# EAGLE design main (EAGLE 7.4.0)
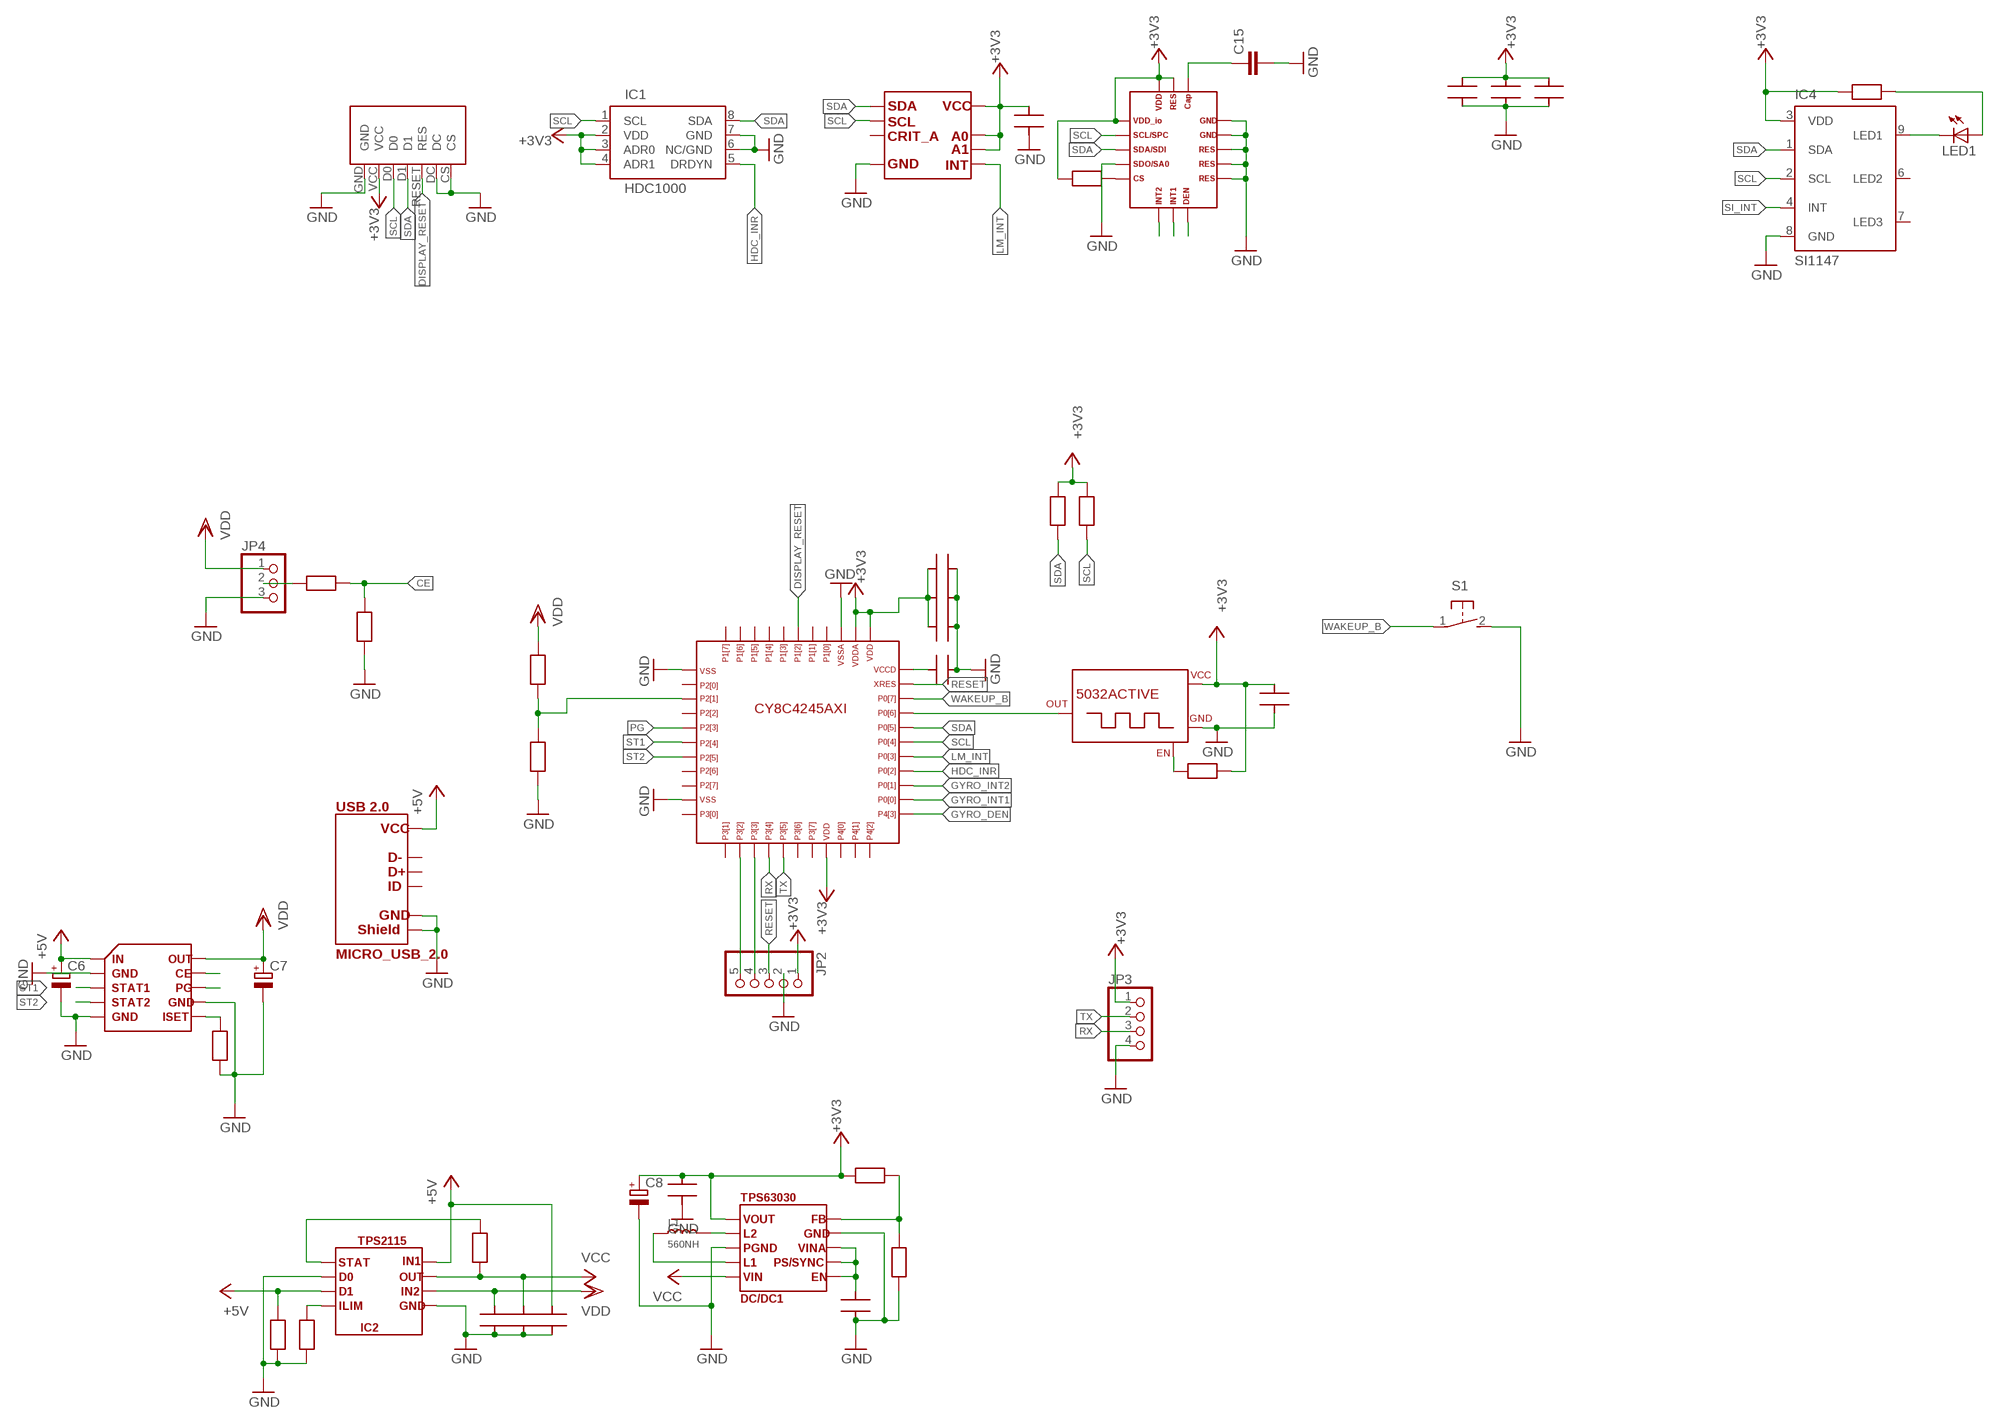
[diagram p0: schematic, sheet 1]

## Parts
C1  CAP0603  [C0603]
C2  CAP0603  [C0603]
C3  CAP0603  [C0603]
C4  CAP0603  [C0603]
C5  CAP0603  [C0603]
C6  CPOL-EUSMCA  [SMC_A]
C7  CPOL-EUSMCA  [SMC_A]
C8  CPOL-EUSMCA  [SMC_A]
C9  CAP0603  [C0603]
C10  CAP0603  [C0603]
C11  CAP0603  [C0603]
C12  CAP0603  [C0603]
C13  CAP0603  [C0603]
C14  CAP0603  [C0603]
C15  C-EUC1206  [C1206]
C18  CAP0603  [C0603]
C19  CAP0603  [C0603]
C20  CAP0603  [C0603]
DC/DC1  TPS63030  [WSON10]
DIS1  ER-OLED_BREACKOUT  [ER-OLED_BRECKOUT]
GYRO1  L3GD20H  [LGA_3X3_16]
IC1  HDC1000  [DSBGA-8]
IC2  TPS2115  [TSSOP8]
IC3  BQ24080-Q1,  [VSON10]
IC4  SI1147  [QFN-10]
JP2  PINHD-1X5  [1X05]
JP3  PINHD-1X4  [1X04]
JP4  PINHD-1X3  [1X03]
L1  560NH  SMD-INDUCTOR-560NH-10%(0805)  [L0805]
LED1  LED3MM  [LED3MM]
R1  RES0603  [R0603]
R2  RES0603  [R0603]
R3  RES0603  [R0603]
R4  RES0603  [R0603]
R5  RES0603  [R0603]
R6  RES0603  [R0603]
R7  RES0603  [R0603]
R8  RES0603  [R0603]
R9  RES0603  [R0603]
R10  RES0603  [R0603]
R11  RES0603  [R0603]
R12  RES0603  [R0603]
R13  RES0603  [R0603]
R14  RES0603  [R0603]
R15  RES0603  [R0603]
S1  31-XX  [B3F-31XX]
TMP1  LM92  [SOIC8-1.27-5X4MM]
U$1  CY8C4245  [TQFP44_CY_LOGO]
U$2  5032ACTIVE  [5030A]
USB_CON1  MICRO_USB_2.0  [MICRO-USB5+4P-SMD-0.65]

## Nets
+3V3: C5.2 C8.+ C10.2 C11.2 C12.2 C13.1 C14.1 C18.1 C19.1 C20.1 DC/DC1.P$1 DIS1.VCC GYRO1.1 GYRO1.15 GYRO1.16 IC1.2(VDD) IC1.3(ADR0) IC1.4(ADR1) IC4.3(VDD) JP2.1 JP3.1 R5.1 R9.2 R10.2 R11.1 R12.2 R13.2 TMP1.6(OUT) TMP1.7(OUT) TMP1.8(OUT) U$1.19 U$1.34 U$1.35 U$2.4(+5V)
+5V: C3.2 C6.+ IC2.P$3 IC2.P$8 IC3.P$1 R2.2 USB_CON1.1
CE: IC3.P$9 R14.1 R15.1
DISPLAY_RESET: DIS1.RESET(RES) U$1.39
GND: C1.1 C2.1 C3.1 C4.1 C5.1 C6.- C7.- C8.- C9.1 C10.1 C11.1 C12.1 C13.2 C14.2 C15.2 C18.2 C19.2 C20.2 DC/DC1.EPAD_B DC/DC1.EPAD_T DC/DC1.EPAD_VIA DC/DC1.P$3 DC/DC1.P$9 DIS1.CS DIS1.DC DIS1.GND GYRO1.4 GYRO1.9 GYRO1.10 GYRO1.11 GYRO1.12 GYRO1.13 IC1.6(NC/GND) IC1.7(GND) IC2.P$2 IC2.P$5 IC3.P$2 IC3.P$5 IC3.P$7 IC3.PAD1 IC3.PAD2 IC3.PAD3 IC3.PAD4 IC3.PAD5 IC4.8(GND) JP2.2 JP3.4 JP4.3 R1.1 R2.1 R4.2 R6.1 R8.1 R15.2 S1.2(S) TMP1.4(OUT) U$1.1 U$1.10 U$1.36 U$2.2(GND) USB_CON1.5 USB_CON1.P$1 USB_CON1.P$2 USB_CON1.P$3 USB_CON1.P$4
GYRO_DEN: GYRO1.8 U$1.23
GYRO_INT1: GYRO1.7 U$1.24
GYRO_INT2: GYRO1.6 U$1.25
HDC_INR: IC1.5(DRDYN) U$1.26
LM_INT: TMP1.5(OUT) U$1.27
N$1: C4.2 DC/DC1.P$6 DC/DC1.P$7 DC/DC1.P$8
N$2: DC/DC1.P$4 L1.1
N$3: DC/DC1.P$2 L1.2
N$4: DC/DC1.P$10 R4.1 R5.2
N$5: IC2.P$4 R1.2
N$6: C9.2 U$1.33
N$7: IC2.P$1 R3.2
N$8: IC3.P$6 R6.2
N$9: JP2.5 U$1.13
N$10: JP2.4 U$1.14
N$11: R7.1 R8.2 U$1.3
N$12: C15.1 GYRO1.14
N$13: U$1.30 U$2.3(OUT)
N$14: R11.2 U$2.1(EN)
N$15: GYRO1.5 R12.1
N$16: LED1.A R13.1
N$17: IC4.9(LED1) LED1.K(C)
N$20: JP4.2 R14.2
PG: IC3.P$8 U$1.5
RESET: JP2.3 U$1.32
RX: JP3.3 U$1.15
SCL: DIS1.D0 GYRO1.2 IC1.1(SCL) IC4.2(SCL) R10.1 TMP1.2(OUT) U$1.28
SDA: DIS1.D1 GYRO1.3 IC1.8(SDA) IC4.1(SDA) R9.1 TMP1.1(OUT) U$1.29
SI_INT: IC4.4(INT)
ST1: IC3.P$3 U$1.6
ST2: IC3.P$4 U$1.7
TX: JP3.2 U$1.16
VCC: C2.2 DC/DC1.P$5 IC2.P$7 R3.1
VDD: C1.2 C7.+ IC2.P$6 IC3.P$10 JP4.1 R7.2
WAKEUP_B: S1.1(P) U$1.31
Unconnected: IC4.6(LED2) IC4.7(LED3) TMP1.3(OUT) U$1.2 U$1.4 U$1.8 U$1.9 U$1.11 U$1.12 U$1.17 U$1.18 U$1.20 U$1.21 U$1.22 U$1.37 U$1.38 U$1.40 U$1.41 U$1.42 U$1.43 U$1.44 USB_CON1.2 USB_CON1.3 USB_CON1.4

## Library data of the parts
C1-C5 C9-C14 C18-C20 = My_RLC:CAP0603: Ceramic Capasitor SMD 0603
C6-C8 = rcl:CPOL-EU: POLARIZED CAPACITOR, European symbol
C15 = rcl:C-EU: CAPACITOR, European symbol
DC/DC1 = My_TI:TPS63030: HIGH EFFICIENCY SINGLE INDUCTOR BUCK-BOOST CONVERTER WITH 1-A SWITCHES. Input Voltage Range: 1.8V to 5.5V. http://www.ti.com/lit/ds/symlink/tps63030.pdf
DIS1 = Displays:ER-OLED_BREACKOUT
GYRO1 = Sensors:L3GD20H: MEMS motion sensor: three-axis digital output gyroscope. Wide supply voltage, 2.2 V to 3.6 V. Low voltage compatible IOs, 1.8 V. http://www.st.com/st-web-ui/static/active/en/resource/technical/document/datasheet/DM00060659.pdf
IC1 = My_TI:HDC1000: HDC1000 edit this description Auto generated by make-symbol-device-package-bsdl.ulp Rev. 43 Source: HDC1000.txt
IC2 = My_TI:TPS2115: AUTOSWITCHING POWER MULTIPLEXER. Wide Operating Voltage Range: 2.8 V to 5.5 V. Adjustable Current Limit. Low Standby Current: 0.5 µA Typical. http://www.ti.com/lit/ds/symlink/tps2115.pdf
IC3 = My_TI:BQ24080-Q1,: 1-A, Single Chip, Li-Ion and Li-Pol Automotive Charger. http://www.ti.com/lit/ds/symlink/bq24081-q1.pdf
IC4 = silabs:SI114*: PROXIMITY/UV/AMBIENT LIGHT SENSOR IC WITH I2C INTERFACE Source: http://www.silabs.com/Support%20Documents/TechnicalDocs/Si1145-46-47.pdf
JP2 = pinhead:PINHD-1X5: PIN HEADER
JP3 = pinhead:PINHD-1X4: PIN HEADER
JP4 = pinhead:PINHD-1X3: PIN HEADER
L1 = Seeed-OPL-Inductor:SMD-INDUCTOR-560NH-10%(0805): 303010046
LED1 = led:LED: LED OSRAM: - CHIPLED LG R971, LG N971, LY N971, LG Q971, LY Q971, LO R971, LY R971 LH N974, LH R974 LS Q976, LO Q976, LY Q976 LO Q996 - Hyper CHIPLED LW Q18S LB Q993, LB Q99A, LB R99A - SideLED LS A670, LO A670, LY A670, LG A670, LP A670 LB A673, LV A673, LT A673, LW A673 LH A674 LY A675 LS A676, LA A676, LO A676, LY A676, LW A676 LS A679, LY A679, LG A679 - Hyper Micro SIDELED® LS Y876, LA Y876, LO Y876, LY Y876 LT Y87S - SmartLED LW L88C, LW L88S LB L89C, LB L89S, LG L890 LS L89K, LO L89K, LY L89K LS L896, LA L896, LO L896, LY L896 - TOPLED LS T670, LO T670, LY T670, LG T670, LP T670 LSG T670, LSP T670, LSY T670, LOP T670, LYG T670 LG T671, LOG T671, LSG T671 LB T673, LV T673, LT T673, LW T673 LH T674 LS T676, LA T676, LO T676, LY T676, LB T676, LH T676, LSB T676, LW T676 LB T67C, LV T67C, LT T67C, LS T67K, LO T67K, LY T67K, LW E67C LS E67B, LA E67B, LO E67B, LY E67B, LB E67C, LV E67C, LT E67C LW T67C LS T679, LY T679, LG T679 LS T770, LO T770, LY T770, LG T770, LP T770 LB T773, LV T773, LT T773, LW T773 LH T774 LS E675, LA E675, LY E675, LS T675 LS T776, LA T776, LO T776, LY T776, LB T776 LHGB T686 LT T68C, LB T68C - Hyper Mini TOPLED® LB M676 - Mini TOPLED Santana® LG M470 LS M47K, LO M47K, LY M47K Source: http://www.osram.convergy.de LUXEON: - LUMILED® LXK2-PW12-R00, LXK2-PW12-S00, LXK2-PW14-U00, LXK2-PW14-V00 LXK2-PM12-R00, LXK2-PM12-S00, LXK2-PM14-U00 LXK2-PE12-Q00, LXK2-PE12-R00, LXK2-PE12-S00, LXK2-PE14-T00, LXK2-PE14-U00 LXK2-PB12-K00, LXK2-PB12-L00, LXK2-PB12-M00, LXK2-PB14-N00, LXK2-PB14-P00, LXK2-PB14-Q00 LXK2-PR12-L00, LXK2-PR12-M00, LXK2-PR14-Q00, LXK2-PR14-R00 LXK2-PD12-Q00, LXK2-PD12-R00, LXK2-PD12-S00 LXK2-PH12-R00, LXK2-PH12-S00 LXK2-PL12-P00, LXK2-PL12-Q00, LXK2-PL12-R00 Source: www.luxeon.com KINGBRIGHT: KA-3528ASYC Source: www.kingbright.com
R1-R15 = My_RLC:RES0603: Resistor SMD 0603
S1 = switch-omron:31-XX: OMRON SWITCH; MPN: B3F-3100; OC_FARNELL: 959704; OC_NEWARK: 36M3582
TMP1 = My_TI:LM92: ±0.33°C Accurate, 12-Bit + Sign Temperature Sensor and Thermal Window Comparator With Two-Wire Interface
U$1 = PsoC:CY8C4245
U$2 = Oscillatrs:5032ACTIVE
USB_CON1 = Interface:MICRO_USB_2.0: Micro USB 2.0

## Board
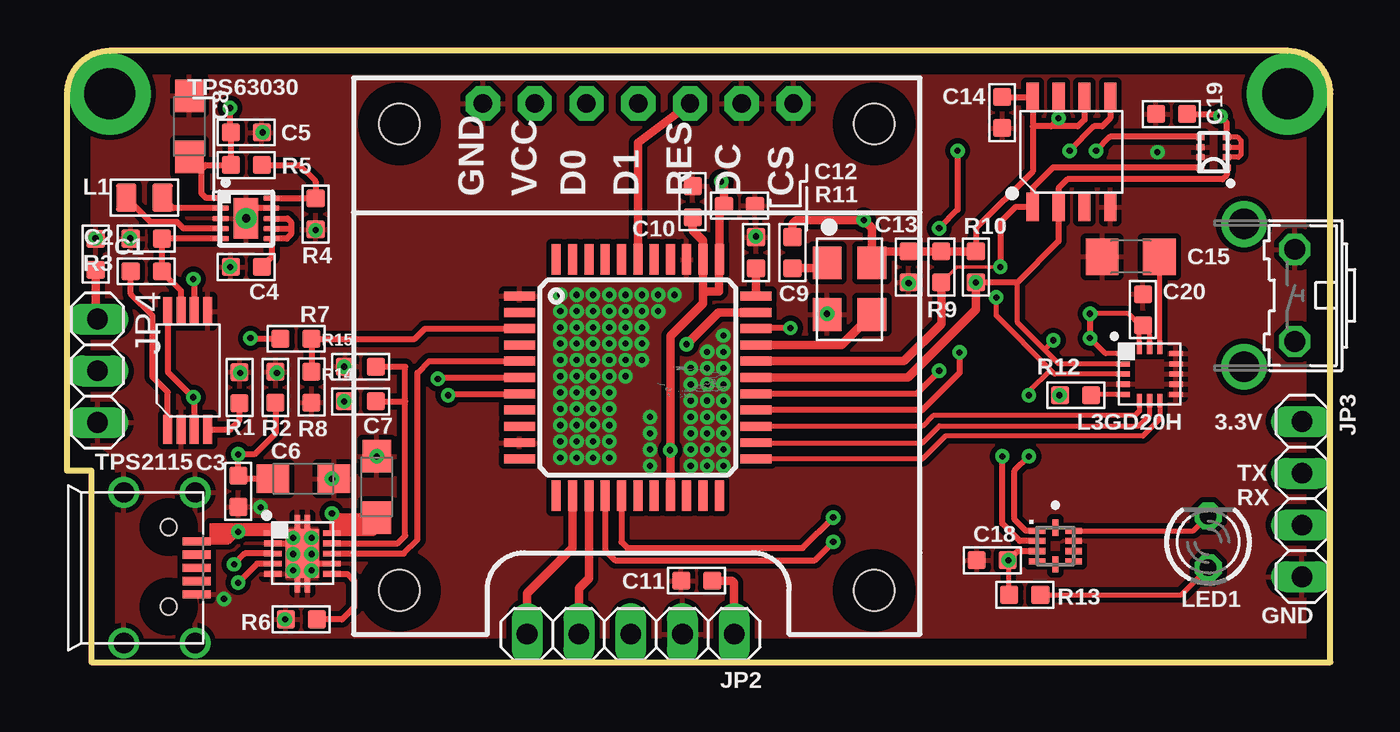
[diagram p1: board, top side]
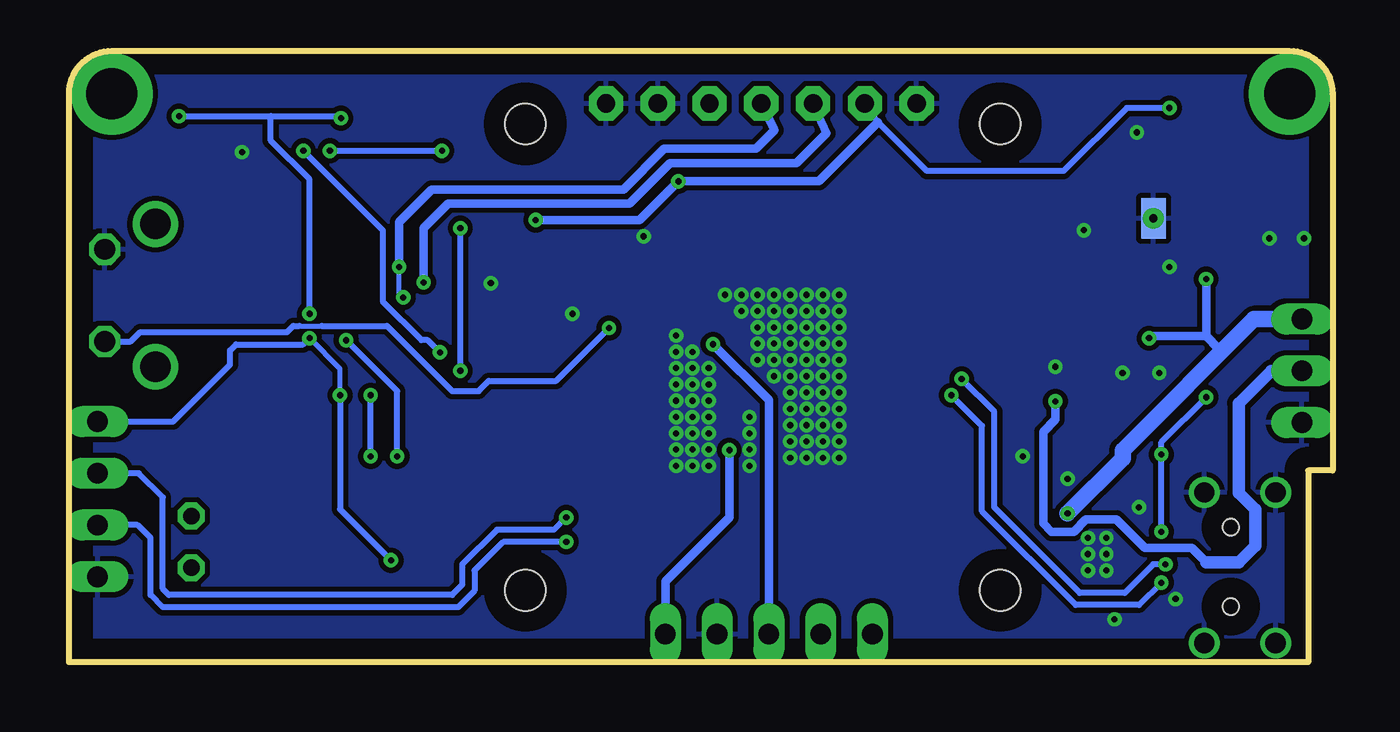
[diagram p2: board, bottom side, seen from below]

Size 62 x 30 mm. Coordinates in mm from the lower left corner, seen from the top.
Outline: 1.2,0 62,0 62,27.9 arc90 59.9,30 2.1,30 arc90 0,27.9 0,9.4 1.2,9.4 1.2,0
Copper layers (1*16): Top 0.035mm / dielectric 1.5mm / Bottom 0.035mm
Design rules "default": minimum track width 10mil, minimum drill 24mil, track to track 8mil, track to pad 8mil, pad to pad 8mil, via to via 8mil, smd to smd 8mil, copper to edge 40mil, drill to drill 8mil, minimum pad ring 10mil, minimum via ring 8mil, stop-mask expansion 4mil, vias tented up to drill 0mil, thermal gap 10mil

### Footprints (pad centres in the part's own frame; a part is rotated, then mirrored left to right if it is on the bottom)
C0603 = smd 0.889 x 0.889: 1 0,0.762; 2 0,-0.762
SMC_A = smd 1.6 x 1.4: + -1.5,0; - 1.5,0
C1206 = smd 1.6 x 1.8: 1 -1.4,0; 2 1.4,0
WSON10 = smd 2 x 1.2 bottom: EPAD_B 0,0 | smd 2 x 1.2: EPAD_T 0,0 | drill 0.4 pad 1.016: EPAD_VIA 0,0 | smd 0.28 x 0.8: P$1 -1,-1.25; P$2 -0.5,-1.25; P$3 0,-1.25; P$4 0.5,-1.25; P$5 1,-1.25; P$6 1,1.25; P$7 0.5,1.25; P$8 0,1.25; P$9 -0.5,1.25; P$10 -1,1.25
ER-OLED_BRECKOUT = drill 0.9 pad 1.676 octagon: CS 7.62,13.45; D0 -2.54,13.45; D1 0,13.45; DC 5.08,13.45; GND -7.62,13.45; RESET 2.54,13.45; VCC -5.08,13.45 | hole 2: -11.72,12.45; -11.72,-10.45; 11.58,-10.45; 11.58,12.45
LGA_3X3_16 = smd 0.25 x 0.65: 1 -1,-1.35; 2 -0.5,-1.35; 3 0,-1.35; 4 0.5,-1.35; 5 1,-1.35; 9 1,1.25; 10 0.5,1.25; 11 0,1.25; 12 -0.5,1.25; 13 -1,1.25 | smd 0.65 x 0.25: 6 1.3,-0.545; 7 1.3,-0.045; 8 1.3,0.455; 14 -1.3,0.455; 15 -1.3,-0.045; 16 -1.3,-0.545
DSBGA-8 = smd 0.4 x 0.3: 1 -0.65,0.75; 2 -0.65,0.25; 3 -0.65,-0.25; 4 -0.65,-0.75; 5 0.65,-0.75; 6 0.65,-0.25; 7 0.65,0.25; 8 0.65,0.75
TSSOP8 = smd 0.45 x 1.4: P$1 -1,-3; P$2 -0.35,-3; P$3 0.3,-3; P$4 0.95,-3; P$5 0.95,2.8; P$6 0.3,2.8; P$7 -0.35,2.8; P$8 -1,2.8
VSON10 = smd 0.28 x 0.85: P$1 -1,-1.5; P$2 -0.5,-1.5; P$3 0,-1.5; P$4 0.5,-1.5; P$5 1,-1.5; P$6 1,1.4; P$7 0.5,1.4; P$8 0,1.4; P$9 -0.5,1.4; P$10 -1,1.4 | smd 2.4 x 1.65: PAD1 0,-0.05 | smd 1.4 x 0.28: PAD2 1.2,0.2; PAD3 1.2,-0.3; PAD4 -1.2,-0.3; PAD5 -1.2,0.2
QFN-10 = smd 0.8 x 0.3: 1 -0.9,0.75; 2 -0.9,0.25; 3 -0.9,-0.25; 4 -0.9,-0.75; 6 0.9,-0.75; 7 0.9,-0.25; 8 0.9,0.25; 9 0.9,0.75 | smd 0.3 x 0.8: 5 0,-0.9; 10 0,0.9
1X05 = drill 1.016 long: 1 -5.08,0; 2 -2.54,0; 3 0,0; 4 2.54,0; 5 5.08,0
1X04 = drill 1.016 long: 1 -3.81,0; 2 -1.27,0; 3 1.27,0; 4 3.81,0
1X03 = drill 1.016 long: 1 -2.54,0; 2 0,0; 3 2.54,0
L0805 = smd 1.016 x 1.397: 1 -0.889,0; 2 0.889,0
LED3MM = drill 0.813 octagon: A -1.27,0; K 1.27,0
R0603 = smd 0.889 x 0.889: 1 0,0.762; 2 0,-0.762
B3F-31XX = drill 1.016 octagon: 1 -2.261,-1.245; 2 2.261,-1.245 | drill 1.499 pad 2.159: 3 -3.505,1.245; 4 3.505,1.245
SOIC8-1.27-5X4MM = smd 0.6 x 1.4: 1 -1.905,-2.7; 2 -0.635,-2.7; 3 0.635,-2.7; 4 1.905,-2.7; 5 1.905,2.7; 6 0.635,2.7; 7 -0.635,2.7; 8 -1.905,2.7
TQFP44_CY_LOGO = smd 1.5 x 0.44: 1 -5.8,4; 2 -5.8,3.2; 3 -5.8,2.4; 4 -5.8,1.6; 5 -5.8,0.8; 6 -5.8,0; 7 -5.8,-0.8; 8 -5.8,-1.6; 9 -5.8,-2.4; 10 -5.8,-3.2; 11 -5.8,-4; 23 5.8,-4; 24 5.8,-3.2; 25 5.8,-2.4; 26 5.8,-1.6; 27 5.8,-0.8; 28 5.8,0; 29 5.8,0.8; 30 5.8,1.6; 31 5.8,2.4; 32 5.8,3.2; 33 5.8,4 | smd 0.44 x 1.5: 12 -4,-5.8; 13 -3.2,-5.8; 14 -2.4,-5.8; 15 -1.6,-5.8; 16 -0.8,-5.8; 17 0,-5.8; 18 0.8,-5.8; 19 1.6,-5.8; 20 2.4,-5.8; 21 3.2,-5.8; 22 4,-5.8; 34 4,5.8; 35 3.2,5.8; 36 2.4,5.8; 37 1.6,5.8; 38 0.8,5.8; 39 0,5.8; 40 -0.8,5.8; 41 -1.6,5.8; 42 -2.4,5.8; 43 -3.2,5.8; 44 -4,5.8
5030A = smd 1.6 x 1.4: 1 0,-2.2; 2 2.54,-2.2; 3 2.54,0; 4 0,0
MICRO-USB5+4P-SMD-0.65 = smd 0.4 x 1.35: 1 -1.3,2.675; 2 -0.65,2.675; 3 0,2.675; 4 0.65,2.675; 5 1.3,2.675 | drill 1: P$1 -3.7,2.6; P$2 3.7,2.6; P$3 -3.7,-0.9; P$4 3.7,-0.9 | hole 0.8: -2,1.3; 1.9,1.3

### Placement (x,y rotation side)
C1  1.41,20.02 0 top
C2  3.89,20.79 90 top
C3  8.41,8.38 180 top
C4  8.8,19.4 90 top
C5  8.8,26 270 top
C6  11.6,9 0 top
C7  15.2,8.6 90 top
C8  6,26.3 90 top
C9  33.81,20.1 0 top
C10  30.7,22.6 0 top
C11  30.9,4 90 top
C12  33,22.4 270 top
C13  41.3,19.4 0 top
C14  45.89,26.98 0 top
C15  52.2,19.9 180 top
C18  45.4,5 270 top
C19  54.2,26.9 270 top
C20  52.8,17.3 180 top
DC/DC1  8.79,21.78 270 top
DIS1  28.03,13.97 0 top
GYRO1  53.17,14.14 270 top
IC1  56.26,25.03 180 top
IC2  5.95,14.42 0 top
IC3  11.6,5.33 270 top
IC4  48.5,5.7 0 top
JP2  27.66,1.37 180 top
JP3  60.6,8 270 top
JP4  1.5,14.3 270 top
L1  3.8,22.8 0 top
LED1  56,5.9 90 top
R1  8.47,13.47 0 top
R2  10.23,13.49 0 top
R3  3.89,19.18 270 top
R4  12.2,22 0 top
R5  8.8,24.4 90 top
R6  11.5,2.1 90 top
R7  11.24,15.87 270 top
R8  12,13.5 180 top
R9  42.9,19.4 180 top
R10  44.6,19.4 180 top
R11  35.6,20.1 0 top
R12  49.5,13.1 270 top
R13  47,3.3 270 top
R14  14.4,12.8 270 top
R15  14.4,14.5 270 top
S1  59,18 90 top
TMP1  49.29,25.04 0 top
U$1  28.01,13.97 0 top
U$2  39.5,19.6 270 top
USB_CON1  3.69,4.63 270 top

### Tracks (layer width: path | path; a pad name or v marks a point on that pad's centre or on a via)
+3V3  (via drill 0.3)
  Top 0.25: GYRO1.1 50.96,15.14 v50.2,15.9 | GYRO1.16 52.62,16.57 | 52.62,16.57 52.1,17.1 v50.2,17.1 | R12.2 v48.7,13.1 | GYRO1.15 53.12,16.07 52.75,16.45 | 52.75,16.45 52.62,16.57 | C20.1 52.8,16.5 52.75,16.45
  Top 0.254: R13.2 46.2,3.34 v46.2,5 C18.1 | IC1.4 57.42,25.78 57.6,25.6 57.6,25.2 | 57.6,25.2 57.6,24.9 57.48,24.78 IC1.2 | IC1.3 57.52,25.28 57.6,25.2 | C8.+ 6.6,24.2
  Top 0.305: DC/DC1.P$1 6.82,22.78 6.6,23 6.6,24.2 6.8,24.4 R5.1 C5.2 8,26.04 v8,27.2 | 47.38,26.3 TMP1.8 C14.1 | 47.38,26.3 47.38,24.09 44.6,21.3 R10.2 | 48.3,26.3 48.66,26.66 v48.66,26.7 TMP1.7 | 48.3,26.3 47.38,26.3 | TMP1.6 49.92,26.62 49.6,26.3 48.3,26.3 | IC1.4 56.91,26.49 v56.6,26.8 56.6,26.9 C19.1 | v50.2,17.1 v50.2,15.9 | v46.2,5 46.65,5.45 IC4.3
  Top 0.406: U$1.19 v29.61,10.39 | v29.61,10.39 v29.6,10.4 | v29.61,10.39 29.61,16.01 31.21,17.61 31.21,18.2 | 31.21,18.2 U$1.35 31.2,20.7 30.7,21.2 C10.2 | 31.21,18.2 32,18.2 U$1.34 32.01,22.17 C12.2 32.24,23.46 v32.1,23.6 | C11.2 32.64,4 32.74,3.9 JP2.1 | U$2.4 39.5,20.2 | 39.5,20.2 39.5,21.3 v39.1,21.7 35.8,21.7 35.6,21.5 R11.1 | 39.5,20.2 39.54,20.16 C13.1 R9.2 R10.2
  Bottom 0.25: v48.7,13.1 48.7,14.4 v50.2,15.9
  Bottom 0.305: v8,27.2 10.1,27.2 13.2,24.1 19.9,24.1 22.3,26.5 DIS1.VCC | v56.6,26.8 52.1,26.8 | 52.1,26.8 48.76,26.8 v48.66,26.7 | v50.2,17.1 50.2,23.7 52.1,25.6 52.1,26.8 | v48.7,13.1 48.7,7.5 v46.2,5 | JP3.1 56.89,11.81 54.1,14.6 54.1,15.3 53.8,15.6 50.5,15.6 v50.2,15.9
  Bottom 0.406: v29.6,10.4 29.6,7.1 32.74,3.96 JP2.1 | 22.3,26.5 25.2,23.6 v32.1,23.6 34,21.7 v39.1,21.7
+5V  (via drill 0.3)
  Top 0.305: USB_CON1.1 7.93,5.93 v8.4,6.4 8.47,6.33 IC3.P$1 | IC2.P$3 6.25,12.95 v6.2,13 4.95,14.25 IC2.P$8 | R2.2 10.23,11.23 9.2,10.2 v8.4,10.2 8.4,9.15 C3.2 8.55,9 C6.+
  Bottom 0.305: v8.4,6.4 v8.4,10.2 8.4,10.8 v6.2,13
CE
  Top 0.305: IC3.P$9 16.23,5.83 16.6,6.2 16.6,12.8 | 16.6,12.8 16.6,14.5 R15.1 | R14.1 16.6,12.8
DISPLAY_RESET
  Top 0.406: U$1.39 28.01,25.51 DIS1.RESET
GND  (via drill 0.3)
  Top 0.305: DC/DC1.P$9 9.29,22.28 DC/DC1.EPAD_B | IC3.P$2 10.83,5.83 v11.1,6.1 | IC3.PAD3 11.3,4.3 v11.1,4.5 | IC3.P$7 12.33,4.83 v12,4.5
  other vias: 12,6.1 12,5.3 11.1,5.3 8.5,14.2 10.3,14.2 1.4,20.8 3.1,20.8 9.6,26 12.2,21.2 8,19.4 10.7,2.1 13,9 15.2,10.1 9.5,7.6 7.7,3.1 37.3,17.1 41.3,18.6 33.8,20.9 53.51,25.03 24.21,18.03 25.01,18.03 25.81,18.03 26.61,18.03 27.41,18.03 28.21,18.03 28.21,17.23 28.21,16.43 28.21,15.63 28.21,14.83 27.41,17.23 27.41,16.43 27.41,15.63 27.41,14.83 27.41,14.03 26.61,17.23 26.61,16.43 26.61,15.63 26.61,14.83 26.61,14.03 26.61,13.23 25.81,17.23 25.81,16.43 25.81,15.63 25.81,14.83 25.81,14.03 25.81,13.23 25.81,12.43 25.01,17.23 25.01,16.43 25.01,15.63 25.01,14.83 25.01,14.03 25.01,13.23 25.01,12.43 24.21,17.23 24.21,16.43 24.21,15.63 24.21,14.83 24.21,14.03 24.21,13.23 24.21,12.43 26.61,12.43 26.61,11.63 26.61,10.83 25.81,11.63 25.81,10.83 25.81,10.03 25.01,11.63 25.01,10.83 25.01,10.03 24.21,11.63 24.21,10.83 24.21,10.03 26.61,10.03 29.01,18.03 29.81,18.03 29.01,17.23 30.61,14.43 31.41,14.43 32.21,14.43 32.21,13.63 32.21,12.83 32.21,12.03 32.21,11.23 31.41,13.63 31.41,12.83 31.41,12.03 31.41,11.23 30.61,13.63 30.61,12.83 30.61,12.03 30.61,11.23 32.21,15.23 32.21,16.03 31.41,15.23 30.61,10.43 30.61,9.63 31.41,10.43 31.41,9.63 32.21,10.43 32.21,9.63 28.61,12.03 28.61,11.23 28.61,10.43 28.61,9.63 13.6,14.5
  pour Top (isolate 0.254): 0,0 62,0 62,30 0,30
  pour Bottom (isolate 0.254): 62,0 0,0 0,30 62,30
GYRO_DEN
  Top 0.25: GYRO1.8 53.62,11.93 52.8,11.1 43.1,11.1 41.97,9.97 U$1.23
GYRO_INT1
  Top 0.25: U$1.24 41.97,10.77 42.8,11.6 52.6,11.6 53.12,12.12 GYRO1.7
GYRO_INT2
  Top 0.25: GYRO1.6 52.62,12.32 52.4,12.1 42.5,12.1 41.97,11.57 U$1.25
HDC_INR  (via drill 0.3)
  Top 0.305: IC1.5 51.18,25.78 v50.5,25.1 | v43.8,15.2 43.8,14.2 41.97,12.37 U$1.26
  Bottom 0.305: v50.5,25.1 46.6,21.2 46.6,17.7 44.7,15.8 44.4,15.8 v43.8,15.2
LM_INT  (via drill 0.3)
  Top 0.305: TMP1.5 51.2,26.7 50.8,26.3 50.4,26.3 v49.2,25.1 | v43.7,25.1 43.7,22.2 v42.8,21.3 | v42.8,14.3 41.67,13.17 U$1.27
  Bottom 0.305: v49.2,25.1 v43.7,25.1 | v42.8,21.3 v42.8,14.3
N$1
  Top 0.305: DC/DC1.P$8 10.82,21.78 11,21.6 11,21.2 | 11,21.2 11,21 10.78,20.78 DC/DC1.P$6 10.04,19.88 C4.2 | DC/DC1.P$7 10.92,21.28 11,21.2
N$2
  Top 0.305: DC/DC1.P$4 5.72,21.28 5.4,21.6 4.11,21.6 L1.1
N$3
  Top 0.305: DC/DC1.P$2 5.21,22.28 L1.2
N$4
  Top 0.305: DC/DC1.P$10 12.18,22.78 R4.1 12.2,23.6 11.4,24.4 R5.2
N$5
  Top 0.305: IC2.P$4 8.02,11.42 8.47,11.87 R1.2
N$6
  Top 0.406: C9.2 U$1.33
N$7
  Top 0.305: IC2.P$1 4.95,13.25 4.2,14 4.2,17 3.13,18.07 R3.2
N$8
  Top 0.305: IC3.P$6 13.77,4.33 14.1,4 14.1,2.7 13.5,2.1 R6.2
N$9
  Top 0.406: U$1.13 24.81,5.61 22.58,3.38 JP2.5
N$10
  Top 0.406: U$1.14 25.61,4.11 25.12,3.62 JP2.4
N$11
  Top 0.305: R8.2 R7.1 17.07,15.87 17.57,16.37 U$1.3
N$12
  Top 0.25: GYRO1.14 53.62,19.88 C15.1
N$13
  Top 0.406: U$1.30 38.01,15.57 U$2.3
N$14
  Top 0.406: R11.2 37.04,19.34 U$2.1
N$15
  Top 0.25: GYRO1.5 50.3,13.14 R12.1
N$16
  Top 0.254: R13.1 54.67,3.3 LED1.A
N$17
  Top 0.254: IC4.9 55.28,6.45 LED1.K
N$18  (via drill 2.5 pad 4)
  other vias: 2.1,27.9
N$19  (via drill 2.5 pad 4)
  other vias: 59.9,27.9
N$20  (via drill 0.3)
  Top 0.406: v13.6,12.8 13.6,12.76 R14.2
  Bottom 0.406: 6.2,4.9 6.9,5.6 9.2,5.6 10.6,7 12.1,7 12.7,6.4 13.8,6.4 14.2,6.8 14.2,11.3 13.6,11.9 v13.6,12.8
  Bottom 0.61: JP4.2 3,14.3 4.6,12.7 4.6,8.3 3.8,7.5 3.8,5.7 4.6,4.9 6.2,4.9
PG
  Top 0.305: IC3.P$8 16.53,5.33 17.2,6 17.2,14.2 17.77,14.77 U$1.5
RESET  (via drill 0.3)
  Top 0.406: v30.4,15.6 31.97,17.17 U$1.32
  Bottom 0.406: JP2.3 27.66,12.86 v30.4,15.6
RX  (via drill 0.3)
  Top 0.305: U$1.15 26.41,5.49 26.9,5 36.7,5 v37.6,5.9
  Bottom 0.305: v37.6,5.9 40.7,5.9 42.1,4.5 42.1,3.5 42.9,2.7 57.4,2.7 58,3.3 58,6.1 58.63,6.73 JP3.3
SCL  (via drill 0.3)
  Top 0.25: GYRO1.2 48.66,14.64 47.95,15.35 46.64,16.66 46.64,18.64
  Top 0.254: v48.4,15.8 47.95,15.35
  Top 0.305: R10.1 46.64,18.64 48.66,20.66 TMP1.2 48.66,23.25 49.1,23.7 56.7,23.7 56.91,23.91 IC1.1 | IC4.2 46.75,5.95 45.9,6.8 v45.9,10.1
  Top 0.406: U$1.28 41.27,13.97 44.6,17.3 R10.1
  Bottom 0.305: v45.9,10.1 45.9,13.3 v48.4,15.8
  Bottom 0.406: R10.1 44.6,21.3 43.4,22.5 34.5,22.5 32.5,24.5 26.3,24.5 24.84,25.96 DIS1.D0
  other vias: 44.6,18.64
SDA  (via drill 0.3)
  Top 0.18: v45.8,19.4 43.66,19.4 R9.1
  Top 0.25: GYRO1.3 48.46,14.14 48.25,14.35 45.6,17 v45.6,17.9
  Top 0.254: v47.2,13.1 47.2,13.3 48.25,14.35
  Top 0.305: v45.8,19.4 45.8,21.6 46.54,22.34 TMP1.1 47.38,23.29 48.38,24.28 IC1.8 | IC4.1 47.05,6.45 46.5,7 46.5,9.4 v47.2,10.1
  Top 0.406: U$1.29 41.07,14.77 42.9,16.6 R9.1
  Bottom 0.25: v45.6,17.9 45.8,18.1 v45.8,19.4
  Bottom 0.305: v47.2,10.1 v47.2,13.1
  Bottom 0.406: DIS1.D1 27.38,26.12 28.3,25.2 32.8,25.2 34.8,23.2 44.2,23.2 45.8,21.6 v45.8,19.4
ST1  (via drill 0.3)
  Top 0.305: IC3.P$3 8.73,5.33 v8.2,4.8 | v18.2,13.9 18.37,13.97 U$1.6
  Bottom 0.305: v18.2,13.9 16.6,12.3 16.6,7.6 12.4,3.4 10.2,3.4 8.8,4.8 v8.2,4.8
ST2  (via drill 0.3)
  Top 0.305: IC3.P$4 9.33,4.83 v8.4,3.9 | v18.7,13.1 18.77,13.17 U$1.7
  Bottom 0.305: v18.7,13.1 17.2,11.6 17.2,7.4 12.6,2.8 9.5,2.8 v8.4,3.9
TX  (via drill 0.3)
  Top 0.305: U$1.16 27.21,5.89 27.5,5.6 36.1,5.6 v37.6,7.1
  Bottom 0.305: v37.6,7.1 38.2,6.5 41,6.5 42.7,4.8 42.7,3.8 43.2,3.3 57.1,3.3 57.4,3.6 57.4,8.1 58.57,9.27 JP3.2
VCC
  Top 0.305: IC2.P$7 5.6,18.23 R3.1 C2.2 4.66,20.78 DC/DC1.P$5
VDD  (via drill 0.3)
  Top 0.305: v6.2,18.8 6.25,18.75 IC2.P$6 | C1.2 1.4,19.25 | v13,7.3 IC3.P$10 15.03,6.33 15.2,6.5 C7.+ | R7.2 9.03,15.87 v9,15.9
  Top 0.406: C1.2 1.41,16.93 JP4.1
  Bottom 0.406: 3.86,16.84 3.96,16.84 5.4,15.4 5.6,15.4 6.2,16 | 6.2,16 8.9,16 v9,15.9 | 6.2,16 v6.2,18.8
  Bottom 0.813: v13,7.3 10.3,10 10.3,10.4 3.86,16.84 JP4.1
WAKEUP_B  (via drill 0.3)
  Top 0.305: v35.5,16.4 33.84,16.4 U$1.31
  Bottom 0.254: 50.7,16.5 49.6,16.5
  Bottom 0.305: S1.1 58.96,15.74 58.5,16.2 51.3,16.2 51,16.5 50.7,16.5 | v35.5,16.4 38.1,13.8 41.4,13.8 41.9,13.3 43.2,13.3 46.4,16.5 49.6,16.5
(copper drawn outside any net)
  shapes: Top area x3

### Text on the board
tNames: 3.3V | TX | RX | GND